# Altium schematic sheet main.SchDoc
size A4; PageSetup: Record=PageOptions|CenterHorizontal=True|CenterVertical=True|PrintScale=1.00|XCorrection=1.00|YCorrection=1.00|PrintKind=0|BorderSize=5000000|LeftOffset=0|BottomOffset=0|Orientation=2|PaperLength=1000|PaperWidth=1000|Scale=100|PaperSource=7|PrintQuality=-4|MediaType=1|DitherType=10|PaperKind=A4|PrintScaleMode=1
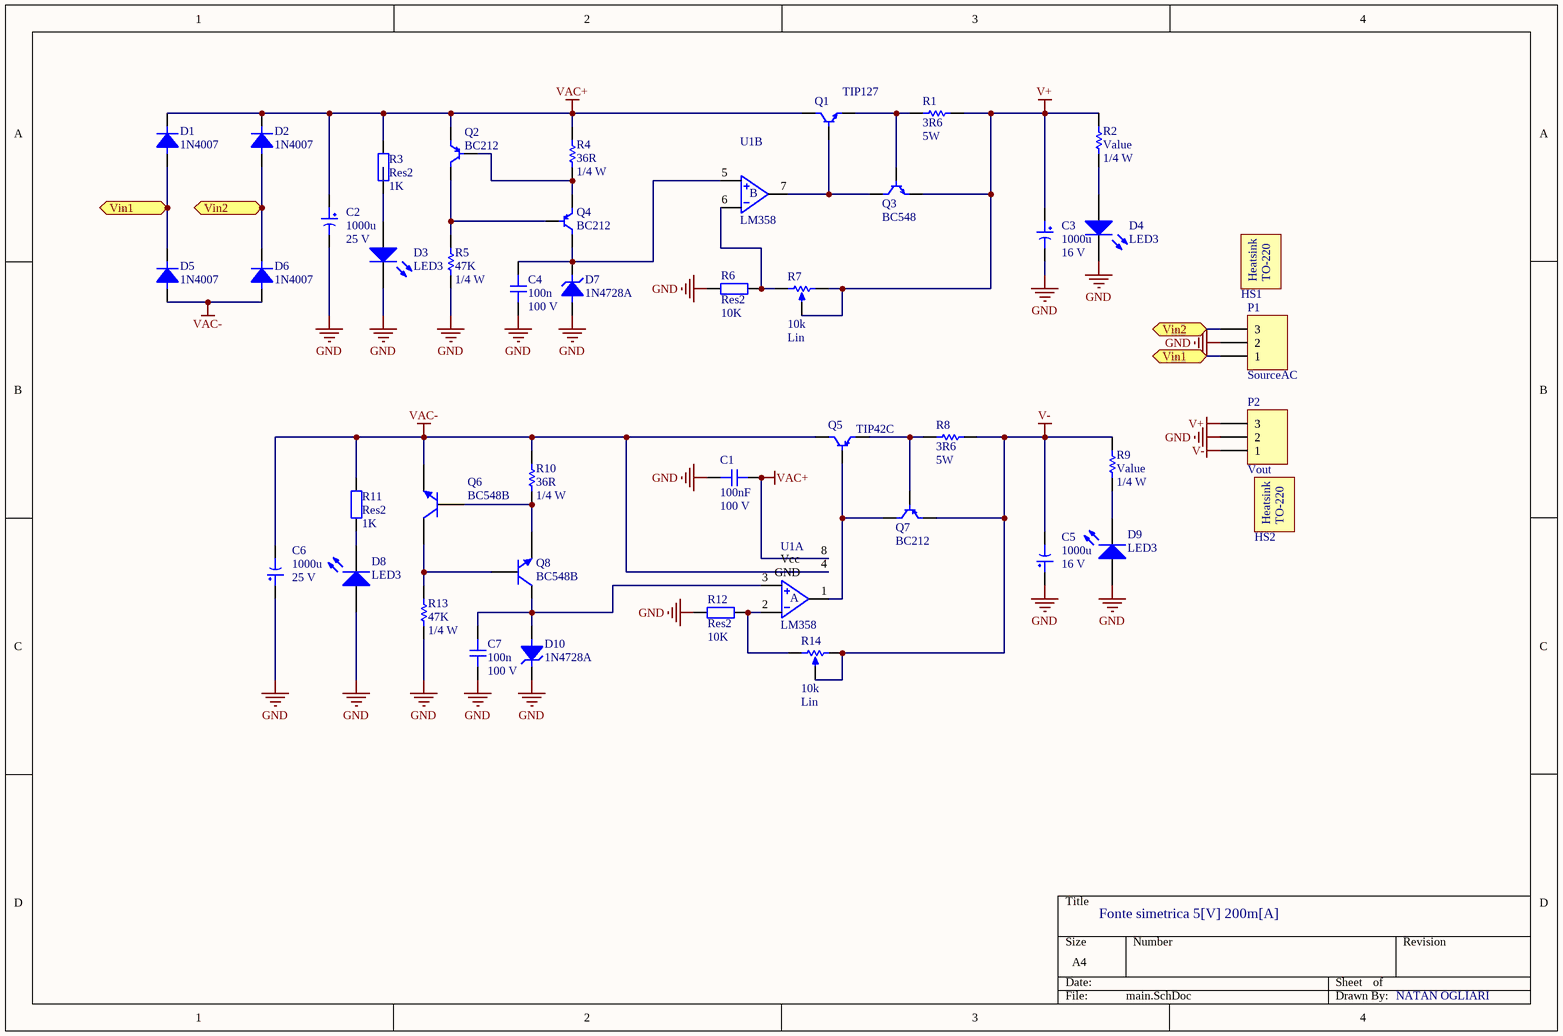
[diagram p0: main.SchDoc]

## Parts
C1  100nF  Voltage: 100 V  [0805C]
C2  1000u  Voltage: 25 V  [CP-RAD-16.0mm-15.0mm-7.5mm]
C3  1000u  Voltage: 16 V  [CP-RAD-16.0mm-31.5mm-7.5mm]
C4  100n  Voltage: 100 V  [C100-200-100]
C5  1000u  Voltage: 16 V  [CP-RAD-16.0mm-15.0mm-7.5mm]
C6  1000u  Voltage: 25 V  [CP-RAD-16.0mm-15.0mm-7.5mm]
C7  100n  Voltage: 100 V  [C100-200-100]
D1  1N4007  [DO-41-Plastic]
D2  1N4007  [DO-41-Plastic]
D3  LED3  [LED 5mm]
D4  LED3  [LED 5mm]
D5  1N4007  [DO-41-Plastic]
D6  1N4007  [DO-41-Plastic]
D7  1N4728A  [DO-41-Glass]
D8  LED3  [LED 5mm]
D9  LED3  [LED 5mm]
D10  1N4728A  [DO-41-Glass]
HS1  HS-TO-220  [HS-TO-220-180847]  (value not drawn)
HS2  HS-TO-220  [HS-TO-220-180847]  (value not drawn)
P1  SourceAC  [KRE_3]
P2  Vout  [KRE_3]
Q1  TIP127  [TO-220/BCE]
Q2  BC212  [TO-92/CBE]
Q3  BC548  [TO-92/CBE]
Q4  BC212  [TO-92/CBE]
Q5  TIP42C  [TO-220AB]
Q6  BC548B  [29-04]
Q7  BC212  [TO-92/CBE]
Q8  BC548B  [29-04]
R1  3R6  Power: 5W  [Res Axial 1W]
R2  Value  Power: 1/4 W  [R400-2.0mm]
R3  Res2  value 1K  [AXIAL-0.4]
R4  36R  Power: 1/4 W  [R400-2.0mm]
R5  47K  Power: 1/4 W  [R400-2.0mm]
R6  Res2  value 10K  [AXIAL-0.4]
R7  10k  Type: Lin  [Trimpot-3266Y]
R8  3R6  Power: 5W  [Res Axial 1W]
R9  Value  Power: 1/4 W  [R400-2.0mm]
R10  36R  Power: 1/4 W  [R400-2.0mm]
R11  Res2  value 1K  [AXIAL-0.4]
R12  Res2  value 10K  [AXIAL-0.4]
R13  47K  Power: 1/4 W  [R400-2.0mm]
R14  10k  Type: Lin  [Trimpot-3266Y]
U1  LM358  [DIP08-300(100)]  (parts A,B of 2)

## Ports
Vin1, Vin2

## Nets
GND: C1.2 C2.2 C3.2 C4.1 C5.1 C6.1 C7.1 D3.2(K) D4.2(K) D7.A D8.1(A) D9.1(A) D10.K P1.2 P2.2 R5.1 R6.1 R12.1 R13.1
V+: C3.1 P2.3 Q3.E R1.2 R2.2 R7.2(TAP) R7.3(BOT)
V-: C5.2 P2.1 Q7.E R8.2 R9.2 R14.2(TAP) R14.3(BOT)
VAC+: C1.1 C2.1 D1.K D2.K Q1.C Q2.E R3.2 R4.2 U1.8(Vcc)
VAC-: C6.2 D5.A D6.A Q5.C Q6.3(E) R10.2 R11.2 U1.4(GND)
Vin1: D1.A D5.K P1.1 ; port Vin1
Vin2: D2.A D6.K P1.3 ; port Vin2
NetC4_2: C4.2 D7.K Q4.C U1.5(IN2+)
NetC7_2: C7.2 D10.A Q8.1(C) U1.3(IN1+)
NetD3_1: D3.1(A) R3.1
NetD4_1: D4.1(A) R2.1
NetD8_2: D8.2(K) R11.1
NetD9_2: D9.2(K) R9.1
NetQ1_B: Q1.B Q3.C U1.7(O2)
NetQ1_E: Q1.E Q3.B R1.1
NetQ2_B: Q2.B Q4.E R4.1
NetQ2_C: Q2.C Q4.B R5.2
NetQ5_B: Q5.B Q7.C U1.1(O1)
NetQ5_E: Q5.E Q7.B R8.1
NetQ6_1: Q6.1(C) Q8.2(B) R13.2
NetQ6_2: Q6.2(B) Q8.3(E) R10.1
NetR6_2: R6.2 R7.1(TOP) U1.6(IN2-)
NetR12_2: R12.2 R14.1(TOP) U1.2(IN1-)

## Notes on the sheet
- Fonte simetrica 5[V] 200m[A]
- NATAN OGLIARI
- (in symbol HS-TO-220) Heatsink; TO-220
- (in symbol LM358, part A) A
- (in symbol LM358, part B) B

## Library data of the parts
C1 C4 C7 = Capacitor: Published: 8-Jun-2000; LatestRevisionDate: 17-Jul-2002; LatestRevisionNote: Re-released for DXP Platform.; PackageReference: RAD-0.3; Publisher: Altium Limited
C2 C3 C5 C6 = Capacitor-Electrolytic: Electrolytic Capacitor
D1 = 1N4007: General Purpose Rectifier; Peak Repetitive Reverse Voltage (Vrrm): 1000 V; Forward Current (If): 2 A; Non-Repetitive Peak Forward Surge Current (Ifsm): 30 A; Forward Voltage (Vf): 1.1 V; Reverse Current (Ir): 5 uA; Total Capacitance (Ct): 15 pF
D2 D5 D6 = 1N4007: General Purpose Rectifier; Peak Repetitive Reverse Voltage (Vrrm): 1000 V; Forward Current (If): 1 A; Non-Repetitive Peak Forward Surge Current (Ifsm): 30 A; Forward Voltage (Vf): 1.1 V; Reverse Current (Ir): 5 uA; Total Capacitance (Ct): 15 pF
D3 D4 D8 D9 = LED3: Typical BLUE SiC LED; pin to pad: 1>A 2>K; Published: 8-Jun-2000; LatestRevisionDate: 17-Dec-2003; LatestRevisionNote: PCB Footprint replaced.; DatasheetVersion: 16-Apr-2002; PackageVersion: 16-Apr-2002; PackageReference: 3.5X2.8X1.9; Publisher: Altium Limited
D7 D10 = 1N4728A: Zener Diode; Zener Voltage (Vz): 3.3 V; Zener Current (Iz): 276 mA; Power Dissipation (Pd): 1.3 W; Forward Voltage (Vf): 1.2 V
HS1 HS2 = HS-TO-220: Heatsink TO-220
P1 P2 = KRE_3: Terminal Block 1x3
Q1 Q3 = BC338: NPN Epitaxial Silicon Transistor; Complementary Part: BC328; Collector-Emitter Voltage (Vce): 30 V; Emitter-Base Voltage (Veb): 5 V; Collector Current (Ic): 800 mA; Total Power Dissipation (Ptot): 625 mW; DC Current Gain Min (hfe): 60; DC Current Gain Max (hfe): 630; Transition Frequency (fT): 100 MHz
Q2 Q4 = BC556: PNP Epitaxial Silicon Transistor; Complementary Part: BC546; Collector-Base Voltage (Vcb): -80 V; Collector-Emitter Voltage (Vce): -65 V; Emitter-Base Voltage (Veb): -5 V; Collector Current (Ic): -100 mA; Total Power Dissipation (Ptot): 500 mW; DC Current Gain Min (hfe): 110; DC Current Gain Max (hfe): 800; Transition Frequency (fT): 150 MHz
Q5 = BC328: PNP Epitaxial Silicon Transistor; pin to pad: B>1 C>2 E>3; Complementary Part: BC338; Collector-Emitter Voltage (Vce): -30 V; Emitter-Base Voltage (Veb): -5 V; Collector Current (Ic): -800 mA; Total Power Dissipation (Ptot): 625 mW; DC Current Gain Min (hfe): 40; DC Current Gain Max (hfe): 630; Transition Frequency (fT): 100 MHz
Q6 Q8 = BC548B: Amplifier Transistor NPN Silicon; Published: 29-Sep-2000; LatestRevisionDate: 17-Jul-2002; LatestRevisionNote: Re-released for DXP Platform.; DatasheetVersion: 1991; PackageVersion: 1996; PackageReference: 29-04; Publisher: Altium Limited; PackageDescription: TO, Flat Index; 3 In-Line, Axial Leads; Body Dia. 4.8mm; Leads 0.48 x 0.5 mm (max); ComponentLink1Description: Manufacturer Link; ComponentLink1URL: http://www.onsemi.com/site/products/landing?taxonomyID=194; ComponentLink2Description: Datasheet; ComponentLink2URL: http://www.onsemi.com/pub/Collateral/BC546-D.PDF
Q7 = BC328: PNP Epitaxial Silicon Transistor; Complementary Part: BC338; Collector-Emitter Voltage (Vce): -30 V; Emitter-Base Voltage (Veb): -5 V; Collector Current (Ic): -800 mA; Total Power Dissipation (Ptot): 625 mW; DC Current Gain Min (hfe): 40; DC Current Gain Max (hfe): 630; Transition Frequency (fT): 100 MHz
R1 R2 R4 R5 R8-R10 R13 = Resistor: Tolerance: 5%; Published: 8-Jun-2000; LatestRevisionDate: 17-Jul-2002; LatestRevisionNote: Re-released for DXP Platform.; PackageReference: AXIAL-0.3; Publisher: Altium Limited
R3 R6 R11 R12 = Res2: Resistor; Published: 8-Jun-2000; LatestRevisionDate: 17-Jul-2002; LatestRevisionNote: Re-released for DXP Platform.; PackageReference: AXIAL-0.4; Publisher: Altium Limited
R7 R14 = Potentiometer
U1 = LM358: Dual Operational Amplifier